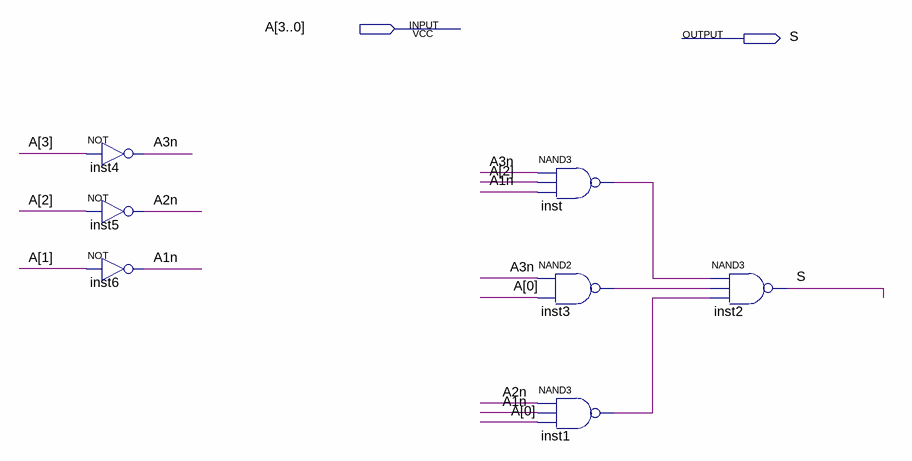
[diagram p0: schematic sheet]
// Quartus schematic E_dupla5.bdf as structural Verilog: 7 symbols, 2 pins
module E_dupla5 (
  input  [3:0] A,
  output S
);

  wire A1n, A2n, A3n, inst1_out, inst3_out, inst_out;

  not inst4 (A3n, A[3]);
  not inst5 (A2n, A[2]);
  not inst6 (A1n, A[1]);
  nand inst (inst_out, A3n, A[2], A1n);
  nand inst3 (inst3_out, A3n, A[0]);
  nand inst1 (inst1_out, A2n, A1n, A[0]);
  nand inst2 (S, inst_out, inst3_out, inst1_out);
endmodule
